# EAGLE design SparkFun_ESP8266_Thing_dimensions_added (EAGLE 7.6.0)
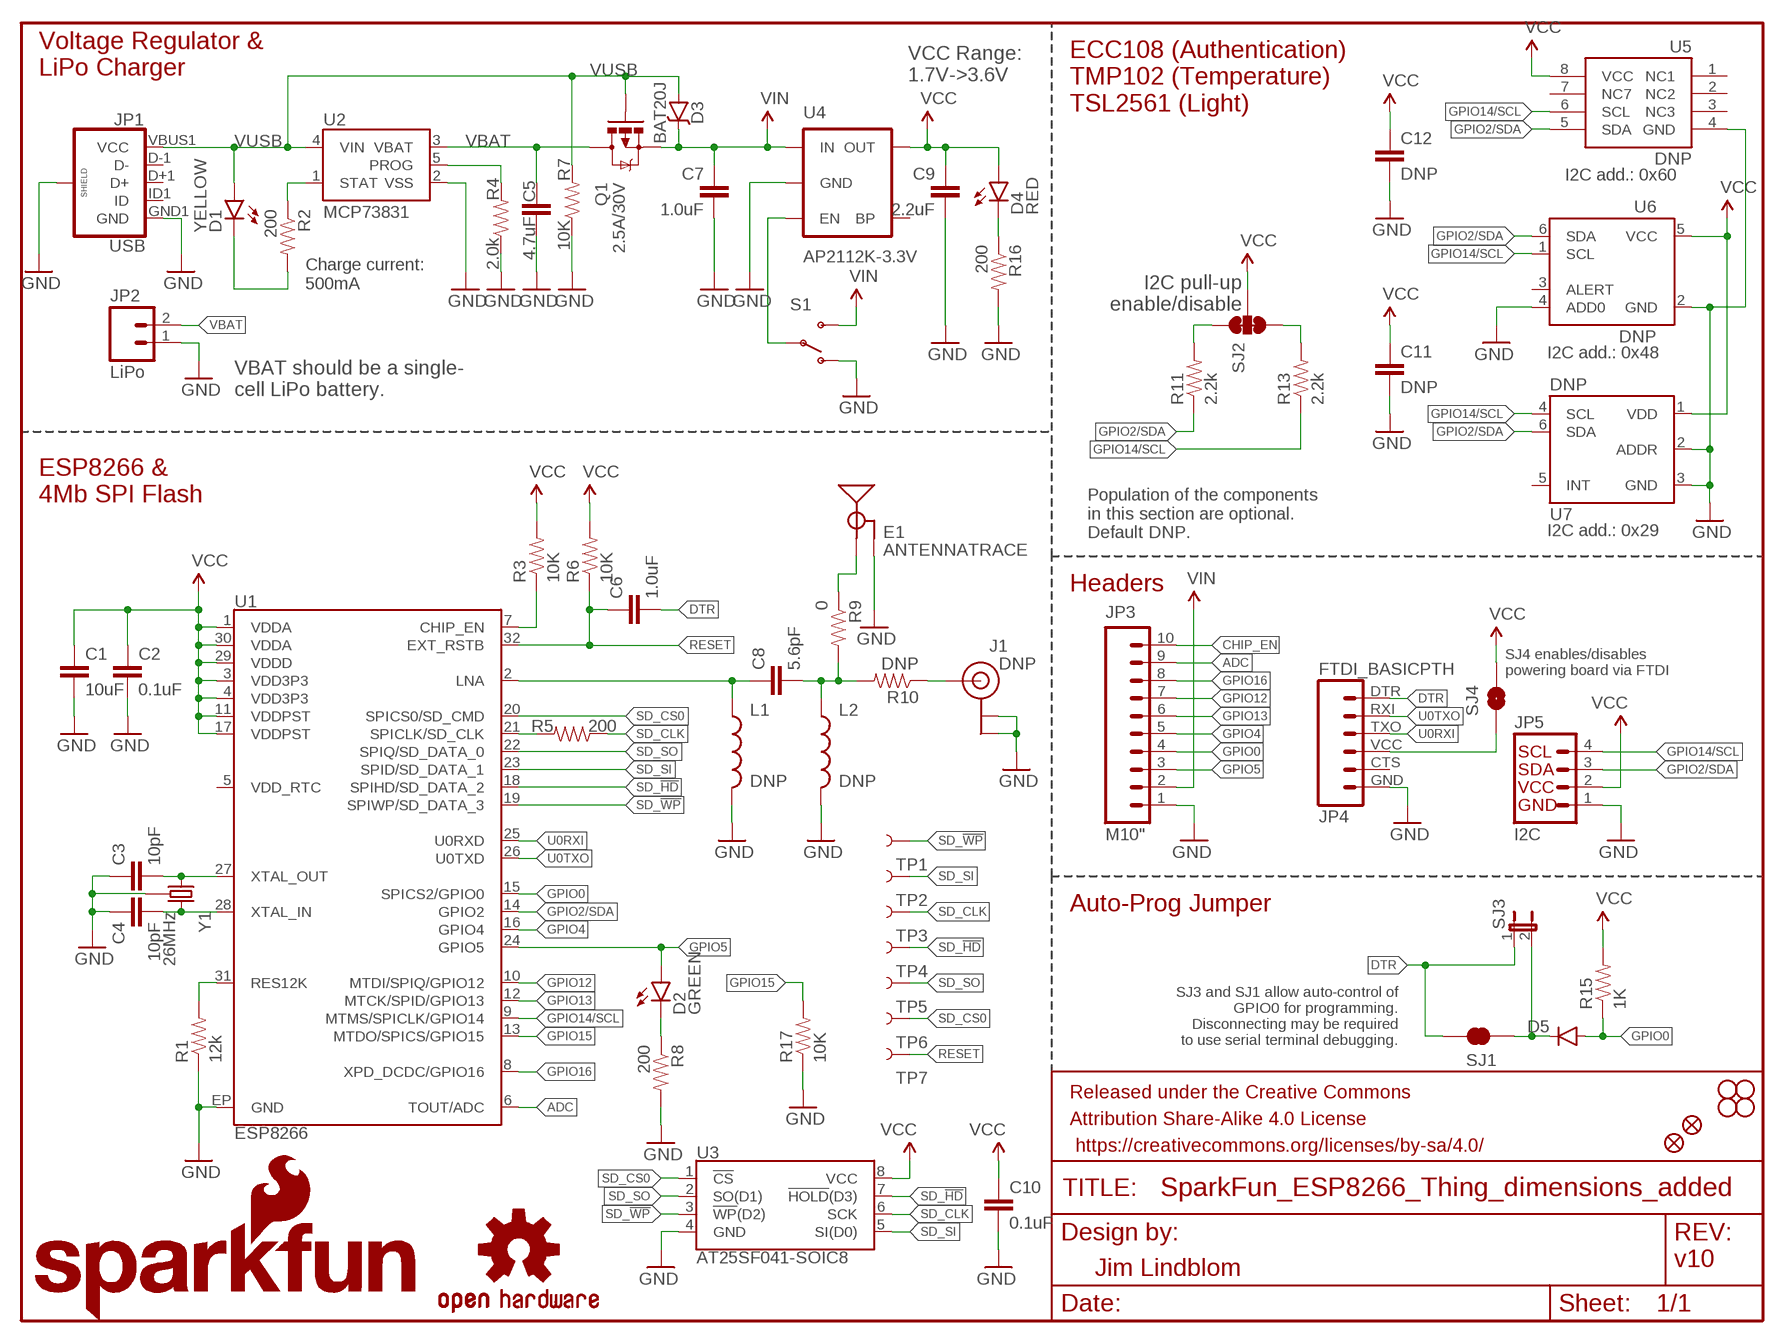
[diagram p0: schematic, sheet 1]

## Parts
C1  10uF  10UF-6.3V-20%(0603)  [0603-CAP]
C2  0.1uF  0.1UF-25V(+80/-20%)(0603)  [0603-CAP]
C3  10pF  10PF-50V-5%(0603)  [0603-CAP]
C4  10pF  10PF-50V-5%(0603)  [0603-CAP]
C5  4.7uF  4.7UF-6.3V-10%(0603)0603  [0603-CAP]
C6  1.0uF  1.0UF-16V-10%(0603)  [0603-CAP]
C7  1.0uF  1.0UF-25V-+80/-20(0805)  [0805]
C8  5.6pF  CAP0603-CAP  [0603-CAP]
C9  2.2uF  2.2UF-10V-20%(0603)  [0603-CAP]
C10  0.1uF  0.1UF-25V(+80/-20%)(0603)  [0603-CAP]
C11  DNP  0.1UF-25V(+80/-20%)(0603)  [0603-CAP]
C12  DNP  0.1UF-25V(+80/-20%)(0603)  [0603-CAP]
D1  YELLOW  LED-YELLOW0603  [LED-0603]
D2  GREEN  LED-GREEN0603  [LED-0603]
D3  BAT20J  DIODE-SCHOTTKY-BAT20J  [SOD-323]
D4  RED  LED-RED0603  [LED-0603]
D5  DIODEBAS16  [SOD-323]
E1  ANTENNATRACE  [TRACE_ANTENNA_2.4GHZ_25.7MM]
FID1  FIDUCIAL1X2  [FIDUCIAL-1X2]
FID2  FIDUCIAL1X2  [FIDUCIAL-1X2]
FRAME1  FRAME-LETTER  [CREATIVE_COMMONS]
J1  DNP  U.FL  [U.FL]
JP1  USB  USB_MICROB_PLUGCONN-11752  [USB-B-MICRO-SMD_V03]
JP2  LiPo  M02JST-PTH-2  [JST-2-PTH]
JP3  M10"  [1X10]
JP4  FTDI_BASICPTH  [FTDI_BASIC]
JP5  I2C  I2C_STANDARD  [1X04]
L1  DNP  INDUCTOR0603  [0603]
L2  DNP  INDUCTOR0603  [0603]
LOGO1  SFE_LOGO_NAME.2_INCH  [SFE_LOGO_NAME_.2]
LOGO3  SFE_LOGO_FLAME.1_INCH  [SFE_LOGO_FLAME_.1]
LOGO4  OSHW-LOGOS  [OSHW-LOGO-S]
Q1  2.5A/30V  MOSFET-PCHANNELDMG2307L  [SOT23-3]
R1  12k  12KOHM-1/10W-1%(0603)  [0603-RES]
R2  200  200OHM1/10W1%(0603)  [0603-RES]
R3  10K  10KOHM1/10W1%(0603)0603  [0603-RES]
R4  2.0k  2.0KOHM1/10W5%(0603)  [0603-RES]
R5  200  200OHM1/10W1%(0603)  [0603-RES]
R6  10K  10KOHM1/10W1%(0603)0603  [0603-RES]
R7  10K  10KOHM1/10W1%(0603)0603  [0603-RES]
R8  200  200OHM1/10W1%(0603)  [0603-RES]
R9  0  0OHM1/10W5%(0603)  [0603]
R10  DNP  RESISTOR0603-RES  [0603-RES]
R11  2.2k  2.2KOHM1/10W1%(0603)  [0603-RES]
R13  2.2k  2.2KOHM1/10W1%(0603)  [0603-RES]
R15  1K  1KOHM1/10W1%(0603)  [0603-RES]
R16  200  200OHM1/10W1%(0603)  [0603-RES]
R17  10K  10KOHM1/10W1%(0603)0603  [0603-RES]
S1  SWITCH-SPDT-SMD-A  [SWITCH-SPST-SMD-A]
SJ1  JUMPER-PAD-2-NC_BY_TRACE  [PAD-JUMPER-2-NC_BY_TRACE_YES_SILK]
SJ2  JUMPER-PAD-3-NC_BY_TRACE  [PAD-JUMPER-3-3OF3_NC_BY_TRACE_YES_SILK_FULL_BOX]
SJ3  JUMPER-PTH-2-NC  [PTH-JUMPER-NC_BOTTOM_NO_SILK]
SJ4  JUMPER-PAD-2-NOYES_SILK  [PAD-JUMPER-2-NO_YES_SILK]
STANDOFF1  STAND-OFF  [STAND-OFF]
STANDOFF2  STAND-OFF  [STAND-OFF]
STANDOFF3  STAND-OFF  [STAND-OFF]
STANDOFF4  STAND-OFF  [STAND-OFF]
TP1  TEST-POINT3X5  [PAD.03X.05]
TP2  TEST-POINT3X5  [PAD.03X.05]
TP3  TEST-POINT3X5  [PAD.03X.05]
TP4  TEST-POINT3X5  [PAD.03X.05]
TP5  TEST-POINT3X5  [PAD.03X.05]
TP6  TEST-POINT3X5  [PAD.03X.05]
TP7  TEST-POINT3X5  [PAD.03X.05]
U1  ESP8266  [QFN32]
U2  MCP73831  [SOT23-5]
U3  AT25SF041-SOIC8  [SO08]
U4  AP2112K-3.3V  V_REG_LDOSMD  [SOT23-5]
U5  DNP  ATECC108-MAHDA  [UDFN8]
U6  DNP  TMP1021:1  [SOT563-2]
U7  DNP  TSL2561FN  [FN-6]
Y1  26MHz  CRYSTAL-GROUNDED3.2X2.5  [CRYSTAL-SMD-3.2X2.5]

## Nets
ADC: JP3.9 U1.6(TOUT/ADC)
ANT: J1.P$3(SIGNAL) R10.1
CHIP_EN: JP3.10 R3.1 U1.7(CHIP_EN)
DTR: C6.2 JP4.DTR SJ1.2 SJ3.1
FTDI_VCC: JP4.VCC SJ4.1
GND: C1.2 C2.2 C3.1 C4.1 C5.2 C7.2 C9.2 C10.2 C11.2 C12.2 E1.GND E1.GND2(GND) J1.P$1(GND) J1.P$2(GND) JP1.GND1(GND) JP1.SHIELD1(SHIELD) JP1.SHIELD2(SHIELD) JP1.SHIELD3(SHIELD) JP2.1 JP3.1 JP4.GND JP5.1 L1.2 L2.2 R1.1 R4.1 R7.1 R8.2 R16.2 R17.1 S1.1(O) U1.EP(GND) U2.2(VSS) U3.4(GND) U4.2(GND) U5.4(GND) U6.2(GND) U6.4(ADD0) U7.2(ADDR) U7.3(GND) Y1.2(GND) Y1.4(GND)
GPIO0: D5.A JP3.4 R15.1 U1.15(SPICS2/GPIO0)
GPIO2/SDA: JP5.3 R11.1 U1.14(GPIO2) U5.5(SDA) U6.6(SDA) U7.6(SDA)
GPIO4: JP3.5 U1.16(GPIO4)
GPIO5: D2.A JP3.3 U1.24(GPIO5)
GPIO12: JP3.7 U1.10(MTDI/SPIQ/GPIO12)
GPIO13: JP3.6 U1.12(MTCK/SPID/GPIO13)
GPIO14/SCL: JP5.4 R13.1 U1.9(MTMS/SPICLK/GPIO14) U5.6(SCL) U6.1(SCL) U7.4(SCL)
GPIO15: R17.2 U1.13(MTDO/SPICS/GPIO15)
GPIO16: JP3.8 U1.8(XPD_DCDC/GPIO16)
LNA: C8.1 L1.1 U1.2(LNA)
N$1: R1.2 U1.31(RES12K)
N$2: C4.2 U1.28(XTAL_IN) Y1.3
N$3: C3.2 U1.27(XTAL_OUT) Y1.1
N$4: D4.C R16.1
N$5: C8.2 L2.1 R9.2 R10.2
N$6: R5.2 U1.21(SPICLK/SD_CLK)
N$7: D5.C SJ1.1 SJ3.2
N$9: R11.2 SJ2.1
N$10: R13.2 SJ2.3
N$11: S1.2(P) U4.3(EN)
N$14: R4.2 U2.5(PROG)
N$15: D2.C R8.1
N$17: D1.C R2.2
N$18: R2.1 U2.1(STAT)
RESET: C6.1 R6.1 TP7.P$1 U1.32(EXT_RSTB)
SD_!HD!: TP4.P$1 U1.18(SPIHD/SD_DATA_2) U3.7(!HOLD!(D3))
SD_!WP!: TP1.P$1 U1.19(SPIWP/SD_DATA_3) U3.3(!WP!(D2))
SD_CLK: R5.1 TP3.P$1 U3.6(SCK)
SD_CS0: TP6.P$1 U1.20(SPICS0/SD_CMD) U3.1(!CS!)
SD_SI: TP2.P$1 U1.23(SPID/SD_DATA_1) U3.5(SI(D0))
SD_SO: TP5.P$1 U1.22(SPIQ/SD_DATA_0) U3.2(SO(D1))
TRACE_ANT: E1.ANT(SIGNAL) R9.1
U0RXI: JP4.TXO U1.25(U0RXD)
U0TXO: JP4.RXI U1.26(U0TXD)
VBAT: C5.1 JP2.2 Q1.3(D) U2.3(VBAT)
VCC: C1.1 C2.1 C9.1 C10.1 C11.1 C12.1 D4.A JP5.2 R3.2 R6.2 R15.2 SJ2.2 SJ4.2 U1.1(VDDA) U1.3(VDD3P3) U1.4(VDD3P3) U1.11(VDDPST) U1.17(VDDPST) U1.29(VDDD) U1.30(VDDA) U3.8(VCC) U4.5(OUT) U5.8(VCC) U6.5(VCC) U7.1(VDD)
VIN: C7.1 D3.C JP3.2 Q1.2(S) S1.3(S) U4.1(IN)
VUSB: D1.A D3.A JP1.VBUS1(VCC) Q1.1(G) R7.2 U2.4(VIN)
Unconnected: JP1.D+1(D+) JP1.D-1(D-) JP1.ID1(ID) JP4.CTS U1.5(VDD_RTC) U4.4(BP) U5.1(NC1) U5.2(NC2) U5.3(NC3) U5.7(NC7) U6.3(ALERT) U7.5(INT)

## Notes on the sheet
- Voltage Regulator &
  LiPo Charger
- VCC Range:
  1.7V->3.6V
- ECC108 (Authentication)
  TMP102 (Temperature)
  TSL2561 (Light)
- I2C add.: 0x60
- Charge current:
  500mA
- I2C pull-up
  enable/disable
- I2C add.: 0x48
- VBAT should be a single-
  cell LiPo battery.
- ESP8266 &
  4Mb SPI Flash
- I2C add.: 0x29
- Population of the components 
  in this section are optional. 
  Default DNP.
- Headers
- DNP
- SJ4 enables/disables
  powering board via FTDI
- Auto-Prog Jumper
- SJ3 and SJ1 allow auto-control of
  GPIO0 for programming.
  Disconnecting may be required
  to use serial terminal debugging.
- v10
- Jim Lindblom

## Library data of the parts
C1 = SparkFun-Capacitors:10UF-6.3V-20%(0603): CAP-11015; PROD_ID: CAP-11015
C2 C10 = SparkFun-Capacitors:0.1UF-25V(+80/-20%)(0603): CAP-00810 Ceramic Standard decoupling cap; PROD_ID: CAP-00810
C3 C4 = SparkFun-Capacitors:10PF-50V-5%(0603): CAP-11812; PROD_ID: CAP-11812
C5 = SparkFun-Capacitors:4.7UF-6.3V-10%(0603): CAP-08280; PROD_ID: CAP-08280
C6 = SparkFun-Capacitors:1.0UF-16V-10%(0603): CAP-00868; PROD_ID: CAP-00868
C7 = SparkFun-Capacitors:1.0UF-25V-+80/-20(0805): CAP-11625; PROD_ID: CAP-11625
C8 = SparkFun-Capacitors:CAP: Capacitor Standard 0603 ceramic capacitor, and 0.1" leaded capacitor.
C9 = SparkFun-Capacitors:2.2UF-10V-20%(0603): CAP-07888; PROD_ID: CAP-07888
C11 C12 = SparkFun-Capacitors:0.1UF-25V(+80/-20%)(0603): CAP-00810 Ceramic Standard decoupling cap; PROD_ID: CAP-00810; VALUE: 0.1uF
D1 = SparkFun-LED:LED-YELLOW: Yellow SMD LEDs LilyPad 1206- DIO-09909 0603- DIO-09003; PROD_ID: DIO-09003
D2 = SparkFun-LED:LED-GREEN: Various green LEDs Green LEDs used in SFE Production 0603- DIO-00821 LARGE- DIO-00862 LILYPAD- DIO-09910; PROD_ID: DIO-00821
D3 = SparkFun-DiscreteSemi:DIODE-SCHOTTKY: Schottky diodes in SFE's production catalog BAT20J 1A 23V 0.62Vf RB751 120mA 40V 0.37Vf PMEG4005EJ 0.5A 40V 0.42Vf MBRA140 1A 40V 0.5Vf B340A 3A 40V SMA; PROD_ID: DIO-11623
D4 = SparkFun-LED:LED-RED: Assorted Red LEDs LilyPad 1206- DIO-09912 1206- DIO-00809 0603- DIO-00819; PROD_ID: DIO-00819
D5 = SparkFun-DiscreteSemi:DIODE: Diode These are standard reverse protection diodes and small signal diodes. SMA package can handle up to about 1A. SOD-323 can handle about 200mA. What the SOD-323 package when ordering, there are some mfgs out there that are 5-pin packages.; PROD_ID: DIO-09646; VALUE: 250mA/100V
E1 = SparkFun-RF:ANTENNA: Chip antenna Chip antenna with ground or secondary connection. Common with larger metal RF connectors.
FID1 FID2 = SparkFun-Aesthetics:FIDUCIAL: Fiducial Alignment Points Various fiducial points for machine vision alignment.
FRAME1 = SparkFun-Aesthetics:FRAME-LETTER: Schematic Frame Standard 8.5x11 US Letter frame
J1 = SparkFun-Connectors:U.FL: SMD antenna connector- WRL-09144; PROD_ID: CONN-09193; VALUE: U.FL
JP1 = SparkFun-Connectors:USB_MICROB_PLUG: USB Micro-B connectors Some male, some female. Watch your step!; PROD_ID: CONN-11752
JP2 = SparkFun-Connectors:M02: Standard 2-pin 0.1" header. Use with - straight break away headers ( PRT-00116) - right angle break away headers (PRT-00553) - swiss pins (PRT-00743) - machine pins (PRT-00117) - female headers (PRT-00115) Molex polarized connector foot print use with: PRT-08233 with associated crimp pins and housings. 2.54_SCREWTERM for use with PRT-10571. 3.5mm Screw Terminal footprints for PRT-08084 5mm Screw Terminal footprints for use with PRT-08432; SKU: PRT-09914
JP3 = SparkFun-Connectors:M10: Header 10 Standard 10-pin 0.1" header. Use with straight break away headers (SKU : PRT-00116), right angle break away headers (PRT-00553), swiss pins (PRT-00743), machine pins (PRT-00117), and female headers (PRT-00115).
JP4 = SparkFun-Connectors:FTDI_BASIC: FTDI Basic header with labels
JP5 = SparkFun-Connectors:I2C_STANDARD: SparkFun has standardized on a pinout for all I2C based sensor breakouts. This pinout allows I2C boards to be plugged directly into the headers on Arduino Uno compatible boards, and to be daisy chained easily.
L1 L2 = SparkFun-Passives:INDUCTOR: Inductors Basic Inductor/Choke - 0603 and 1206. Footprints are not proven and vary greatly between part numbers. SRN6045- 33uH, 20% 1.4A SDR0403-560KL - 56uH, 10%, 500mA RMS/740mA peak
LOGO1 = SparkFun-Aesthetics:SFE_LOGO_NAME: SFE Logo, name only This is the SparkFun name logo. The logo on the schematic will always be the same size; the package variant is the height of the flame part of the logo (or the height the flame would be, if it were drawn). Default layer for the logo on the board is tSilk.
LOGO3 = SparkFun-Aesthetics:SFE_LOGO_FLAME: SFE Logo, flame only This is the SparkFun flame logo. The logo on the schematic will always be the same size; the package variant is the height of the flame. Default layer for the logo on the board is tSilk.
LOGO4 = SparkFun-Aesthetics:OSHW-LOGO: Open Source Hardware Logo This logo indicates the piece of hardware it is found on incorporates a OSHW license and/or adheres to the definition of open source hardware found here: http://freedomdefined.org/OSHW
Q1 = SparkFun-DiscreteSemi:MOSFET-PCHANNEL: Generic PMOSFET IRLML2244 - TRANS-11153 (SOT-23 -20V -4.3A) (1.Gate 2.Source 3.Drain) FQP27P06 - COM-10349 <http://www.sparkfun.com/products/10349> (TO-220 -60V -27A) (1.Gate 2.Source 3.Drain); PROD_ID: TRANS-11308
R1 = SparkFun-Resistors:12KOHM-1/10W-1%(0603): RES-10327; PROD_ID: RES-10327
R2 R5 R8 R16 = SparkFun-Resistors:200OHM1/10W1%(0603): RES-08220; PROD_ID: RES-08220
R3 R6 R7 R17 = SparkFun-Resistors:10KOHM1/10W1%(0603): RES-00824; PROD_ID: RES-00824
R4 = SparkFun-Resistors:2.0KOHM1/10W5%(0603): RES-08296; PROD_ID: RES-08296
R9 = SparkFun-Resistors:0OHM1/10W5%(0603): RES-08609; PROD_ID: RES-08609
R10 = SparkFun-Passives:RESISTOR: Resistor Basic schematic elements and footprints for 0603, 1206, and PTH resistors.
R11 R13 = SparkFun-Resistors:2.2KOHM1/10W1%(0603): RES-08272; PROD_ID: RES-08272
R15 = SparkFun-Resistors:1KOHM1/10W1%(0603): RES-07856; PROD_ID: RES-07856
S1 = SparkFun-Electromechanical:SWITCH-SPDT: SPDT Switch Simple slide switch, Spark Fun Electronics SKU : COM-00102 DPDT SMT slide switch, AYZ0202, SWCH-08179; PROD_ID: SWCH-10651
SJ1 = SparkFun-Passives:JUMPER-PAD-2-NC_BY_TRACE
SJ2 = SparkFun-Passives:JUMPER-PAD-3-NC_BY_TRACE
SJ3 = SparkFun-Passives:JUMPER-PTH-2-NC
SJ4 = SparkFun-Passives:JUMPER-PAD-2-NO
STANDOFF1-STANDOFF4 = SparkFun-Electromechanical:STAND-OFF: #4 Stand Off This is the mechanical footprint for a #4 phillips button head screw. Use the keepout ring to avoid running the screw head into surrounding components. SKU : PRT-00447
TP1-TP7 = SparkFun-Passives:TEST-POINT: Bare copper test points for troubleshooting or ICT
U1 = SparkFun-RF:ESP8266: Espressif ESP8266 WiFi Smart Connectivity Platform.; PROD_ID: IC-12452
U2 = SparkFun-PowerIC:MCP73831: Miniature single cell, fully integrated Li-Ion, Li-polymer charge management controller http://ww1.microchip.com/downloads/en/DeviceDoc/21984a.pdf IC-09995; PROD_ID: IC-09995
U3 = SparkFun-DigitalIC:AT25SF041: SPI Serial Flash Memory with Dual/Quad-IO Support Example: Adesto Technologies AT25SF041-SSHD-T (1265-1131-1-ND) <http://www.digikey.com/product-detail/en/AT25SF041-SSHD-T/1265-1131-1-ND/4824165>; PROD_ID: IC-12455
U4 = SparkFun-PowerIC:V_REG_LDO: Voltage Regulator LDO Standard 150mA LDO voltage regulator in SOT-23 layout. Micrel part MIC5205. BP (by-pass) pin is used to lower output noise with 470pF cap.; PROD_ID: VREG-12457
U5 = SparkFun-DigitalIC:ATECC108: ATECC108: Provides ECDSA with NIST curves P256, B283, and K283. Also, a RNG, 8.5Kb EEPROM. 2.0V - 5.5V.; PROD_ID: IC-12453
U6 = SparkFun-Sensors:TMP102: I2C degC temp sensor
U7 = SparkFun-Sensors:TSL2561: TSL2561 illumination sensor Approximates Human Eye Response Precisely Measures Illuminance Programmable Interrupt Function with User-Defined Upper and Lower Threshold 400 KHz I2C interface Programmable Analog Gain and Integration Time Supporting 1,000,000-to-1 Dynamic Range Automatically Rejects 50/60-Hz Lighting Ripple Low Active Power (0.75 mW Typical) with Power Down Mode RoHS Compliant The TSL2561 is a light-to-digital converter that transform light intensity to a digital signal output via I2C interface. The device combines one broadband photodiode (visible plus infrared) and one infrared-responding photodiode on a single CMOS integrated circuit capable of providing a near-photopic response over an effective 20-bit dynamic range (16-bit resolution). Two integrating ADCs convert the photodiode currents to a digital output that represents the irradiance measured on each channel. This digital output can be input to a microprocessor where illuminance (ambient light level) in lux is derived using an empirical formula to approximate the human eye response. The TSL2561 device supports a traditional level style interrupt that remains asserted until the firmware clears it.
Y1 = things:CRYSTAL-GROUNDED; PROD_ID: XTAL-12454

## Board
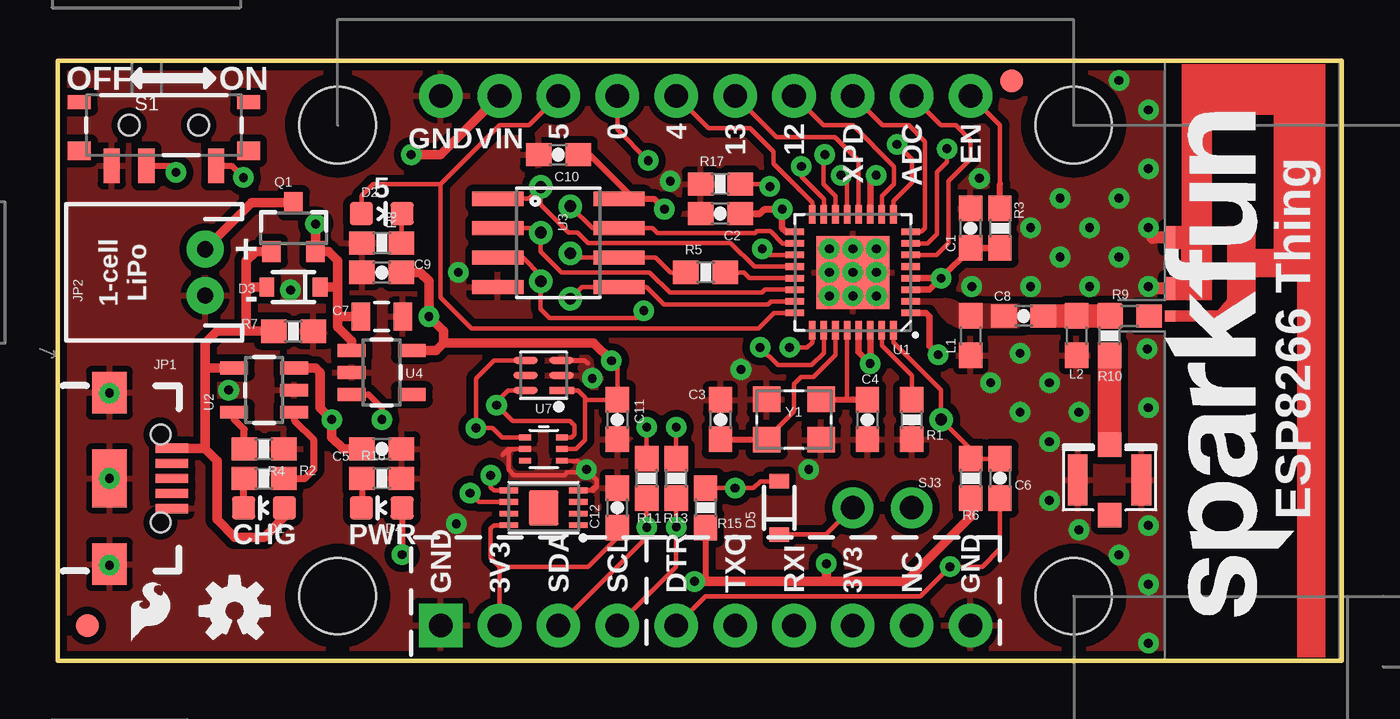
[diagram p1: board, top side]
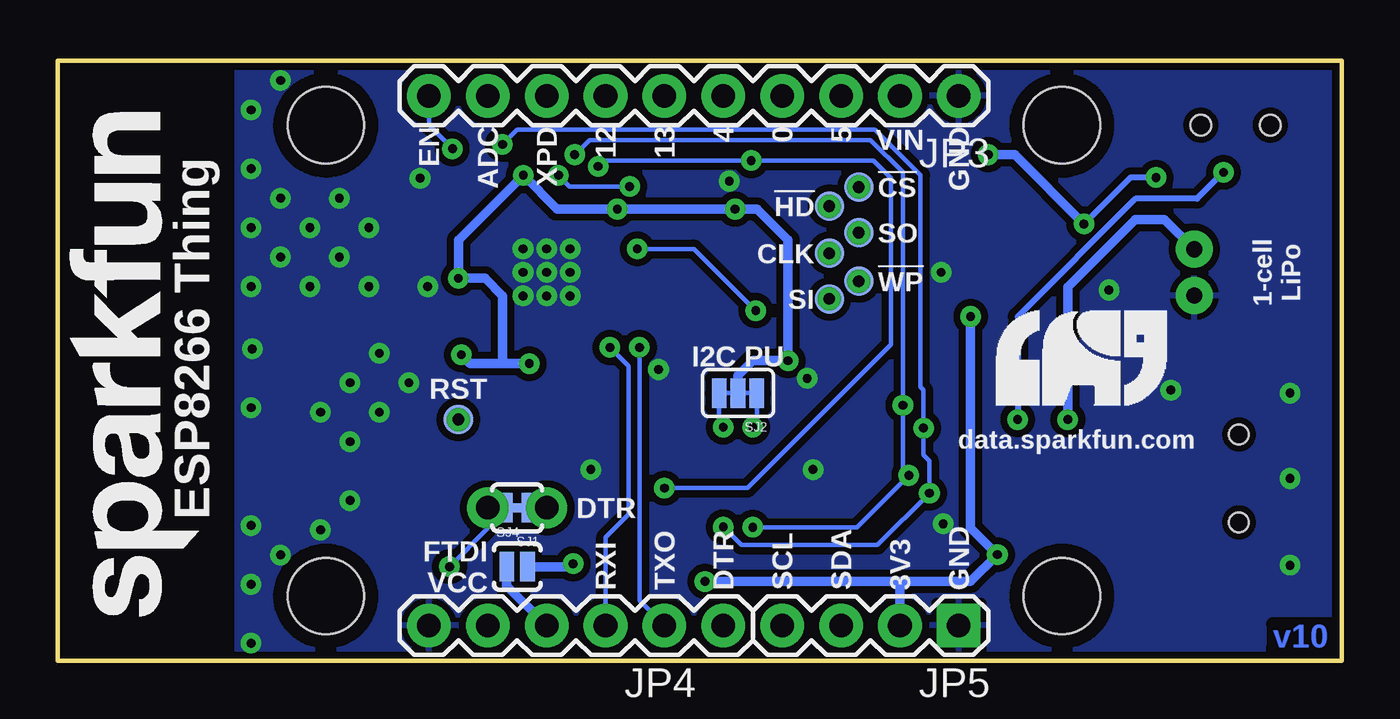
[diagram p2: board, bottom side, seen from below]

Size 55.37 x 25.91 mm. Coordinates in mm from the lower left corner, seen from the top.
Outline: 0,0 0,25.91 55.37,25.91 55.37,0 0,0
Copper layers (1*16): Top 0.035mm / dielectric 1.5mm / Bottom 0.035mm
Design rules "SparkFun-2-layer": minimum track width 7mil, minimum drill 15mil, track to track 8mil, track to pad 8mil, pad to pad 8mil, via to via 8mil, smd to smd 8mil, copper to edge 8mil, drill to drill 8mil, minimum pad ring 12mil, minimum via ring 10mil, stop-mask expansion 4mil, vias tented up to drill 20mil, thermal gap 10mil
tRestrict: 3 lines

### Footprints (pad centres in the part's own frame; a part is rotated, then mirrored left to right if it is on the bottom)
0603-CAP = smd 1.1 x 1: 1 -0.85,0; 2 0.85,0
0805 = smd 0.8 x 1.2: 1 -0.9,0; 2 0.9,0
LED-0603 = smd 1 x 1: A 0,-0.877; C 0,0.877
SOD-323 = smd 0.63 x 0.83: A 1.15,0; C -1.15,0
TRACE_ANTENNA_2.4GHZ_25.7MM = smd 0.46 x 0.46: ANT 0,0.23 | smd 1 x 0.46: GND -1.18,0.23; GND2 -3.38,0.23
FIDUCIAL-1X2 = smd 1 x 1: 1 0,0
U.FL = smd 2.2 x 0.85: P$1 0,1.375; P$2 0,-1.375 | smd 1.05 x 1: P$3 1.525,0; P$4 -1.525,0
USB-B-MICRO-SMD_V03 = smd 1.4 x 0.4: D+1 2.7,0; D-1 2.7,0.65; GND1 2.7,-1.3; ID1 2.7,-0.65; VBUS1 2.7,1.3 | smd 1.5 x 1.8: SHIELD1 0,3.7; SHIELD2 0,-3.7 | smd 1.5 x 2.5: SHIELD3 0,0 | hole 0.85: 2.2,1.9; 2.2,-1.9
JST-2-PTH = drill 0.7 pad 1.6: 1 -1,0; 2 1,0
1X10 = drill 1.016 pad 1.88: 1 0,0; 2 2.54,0; 3 5.08,0; 4 7.62,0; 5 10.16,0; 6 12.7,0; 7 15.24,0; 8 17.78,0; 9 20.32,0; 10 22.86,0
FTDI_BASIC = drill 1.016 pad 1.88: CTS 10.16,0; DTR 0,0; GND 12.7,0; RXI 2.54,0; TXO 5.08,0; VCC 7.62,0
1X04 = drill 1.016 pad 1.88 square: 1 0,0 | drill 1.016 pad 1.88: 2 2.54,0; 3 5.08,0; 4 7.62,0
0603 = smd 1.1 x 1: 1 -0.85,0; 2 0.85,0
SOT23-3 = smd 0.8 x 0.9: 1 -0.95,-1; 2 0.95,-1; 3 0,1.1
0603-RES = smd 1.1 x 1: 1 -0.85,0; 2 0.85,0
SWITCH-SPST-SMD-A = smd 0.7 x 1.5: 1 -2.25,-1.75; 2 -0.75,-1.75; 3 2.25,-1.75 | smd 1 x 0.6: GND1 -3.65,1; GND3 3.65,1 | smd 1 x 0.8: GND2 -3.65,-1.1; GND4 3.65,-1.1 | hole 0.9: -1.5,0; 1.5,0
PAD-JUMPER-2-NC_BY_TRACE_YES_SILK = smd 0.635 x 1.27: 1 -0.508,0; 2 0.508,0
PAD-JUMPER-3-3OF3_NC_BY_TRACE_YES_SILK_FULL_BOX = smd 0.635 x 1.27: 1 -0.813,0; 2 0,0; 3 0.813,0
PTH-JUMPER-NC_BOTTOM_NO_SILK = drill 1.016 pad 1.778: 1 -1.27,0; 2 1.27,0 | smd 1.27 x 0.381 bottom: P$1 0,0
PAD-JUMPER-2-NO_YES_SILK = smd 0.635 x 1.27: 1 -0.45,0; 2 0.45,0
STAND-OFF = hole 3.302: 0,0
PAD.03X.05 = smd 1.27 x 1.27: P$1 0,0
QFN32 = smd 0.8 x 0.285: 1 -2.5,1.75; 2 -2.5,1.25; 3 -2.5,0.75; 4 -2.5,0.25; 5 -2.5,-0.25; 6 -2.5,-0.75; 7 -2.5,-1.25; 8 -2.5,-1.75; 17 2.5,-1.75; 18 2.5,-1.25; 19 2.5,-0.75; 20 2.5,-0.25; 21 2.5,0.25; 22 2.5,0.75; 23 2.5,1.25; 24 2.5,1.75 | smd 0.285 x 0.8: 9 -1.75,-2.5; 10 -1.25,-2.5; 11 -0.75,-2.5; 12 -0.25,-2.5; 13 0.25,-2.5; 14 0.75,-2.5; 15 1.25,-2.5; 16 1.75,-2.5; 25 1.75,2.5; 26 1.25,2.5; 27 0.75,2.5; 28 0.25,2.5; 29 -0.25,2.5; 30 -0.75,2.5; 31 -1.25,2.5; 32 -1.75,2.5 | smd 3.15 x 3.15: EP 0,0
SOT23-5 = smd 0.55 x 1.2: 1 -0.95,-1.3; 2 0,-1.3; 3 0.95,-1.3; 4 0.95,1.3; 5 -0.95,1.3
SO08 = smd 0.61 x 2.21: 1 -1.905,-2.616; 2 -0.635,-2.616; 3 0.635,-2.616; 4 1.905,-2.616; 5 1.905,2.616; 6 0.635,2.616; 7 -0.635,2.616; 8 -1.905,2.616
UDFN8 = smd 0.8 x 0.25: 1 -1.5,0.75; 2 -1.5,0.25; 3 -1.5,-0.25; 4 -1.5,-0.75; 5 1.5,-0.75; 6 1.5,-0.25; 7 1.5,0.25; 8 1.5,0.75 | smd 1.3 x 1.5: EP 0,0
SOT563-2 = smd 0.508 x 0.249: 1 -0.8,0.498; 2 -0.8,0.003; 3 -0.8,-0.506; 4 0.776,-0.506; 5 0.776,0.003; 6 0.776,0.498
FN-6 = smd 1.05 x 0.3: 1 -0.775,0.65; 2 -0.775,0; 3 -0.775,-0.65; 4 0.775,-0.65; 5 0.775,0; 6 0.775,0.65
CRYSTAL-SMD-3.2X2.5 = smd 1.2 x 1.1: 1 -1.175,-0.875; 2 1.175,-0.875; 3 1.175,0.875; 4 -1.175,0.875

### Placement (x,y rotation side)
C1  39.37,18.67 90 top
C2  28.57,19.3 180 top
C3  28.57,10.41 270 top
C4  34.92,10.41 90 top
C5  13.97,9.14 0 top
C6  40.64,7.87 270 top
C7  13.97,14.86 0 top
C8  41.66,14.88 0 top
C9  13.97,16.76 180 top
C10  21.59,21.84 180 top
C11  24.13,10.41 270 top
C12  24.13,6.6 90 top
D1  8.89,6.6 90 top
D2  13.97,19.3 270 top
D3  10.16,16.13 180 top
D4  13.97,6.6 90 top
D5  31.11,6.6 90 top
E1  47.75,14.88 270 top
FID1  41.15,25.02 0 top
FID2  1.27,1.52 0 top
FRAME1  -2.03,-18.29 0 top  (outside the outline)
J1  45.36,7.81 90 top
JP1  2.22,7.87 0 top
JP2  6.35,16.76 90 top
JP3  16.51,24.38 180 bottom
JP4  26.67,1.52 180 bottom
JP5  16.51,1.52 180 bottom
L1  39.37,14.03 270 top
L2  43.94,14.03 270 top
LOGO1  49.28,1.91 90 bottom
LOGO3  2.83,0.5 0 top
LOGO4  7.62,2.16 0 top
LOGO5  SFE_LOGO_NAME.2_INCH  [SFE_LOGO_NAME_.2]  53.34,1.91 90 top
Q1  10.16,18.67 0 top
R1  36.83,10.41 90 top
R2  8.89,7.87 180 top
R3  40.64,18.67 270 top
R4  8.89,9.14 180 top
R5  27.94,16.76 0 top
R6  39.37,7.87 270 top
R7  10.16,14.22 180 top
R8  13.97,18.03 180 top
R9  46.23,14.88 180 top
R10  45.36,14.03 90 top
R11  25.4,7.87 90 top
R13  26.67,7.87 90 top
R15  27.94,6.6 270 top
R16  13.97,7.87 0 top
R17  28.57,20.57 0 top
S1  4.57,23.11 0 top
SJ1  35.56,6.6 180 bottom
SJ2  26.04,11.56 180 bottom
SJ3  35.56,6.6 180 top
SJ4  35.56,4.06 0 bottom
STANDOFF1  43.81,23.11 0 top
STANDOFF2  43.81,2.79 0 top
STANDOFF3  12.06,23.11 0 top
STANDOFF4  12.06,2.79 0 top
TP1  20.83,16.38 0 bottom
TP2  22.1,15.62 0 bottom
TP3  22.1,17.59 0 bottom
TP4  22.1,19.62 0 bottom
TP5  20.83,18.48 0 bottom
TP6  20.83,20.45 0 bottom
TP7  38.1,10.41 0 bottom
U1  34.29,16.76 180 top
U2  8.89,11.68 90 top
U3  21.59,18.03 270 top
U4  13.97,12.45 270 top
U5  20.95,6.6 180 top
U6  20.95,9.14 0 top
U7  20.95,12.32 180 top
Y1  31.75,10.41 0 top

### Tracks (layer width: path | path; a pad name or v marks a point on that pad's centre or on a via)
ADC
  Top 0.203: U1.6 37.9,17.51 38.42,18.03 38.42,20.7 39.37,21.65 39.37,22.48 38.73,23.11 38.1,23.11 JP3.9
ANT
  Top 1.016: R10.1 J1.P$3
CHIP_EN  (via drill 0.38)
  Top 0.203: U1.7 37.51,18.01 37.91,18.42 37.91,21.08 38.35,21.53 v38.35,22.1 | 40.64,20.57 40.64,23.11 JP3.10
  Top 0.254: R3.1 40.64,20.57
  Bottom 0.203: v38.35,22.1 39.37,23.11 JP3.10
DTR  (via drill 0.38)
  Top 0.203: JP4.DTR 27.94,2.79 37.21,2.79 v38.48,4.06 39.88,4.06 40.64,4.83 C6.2
  Bottom 0.203: v38.48,4.06 36.83,5.71 SJ3.1 SJ1.2
FTDI_VCC
  Bottom 0.406: JP4.VCC 36.01,3.24 SJ4.1
GND  (via drill 0.38)
  Top 0.203: 23.11,7.49 22.98,7.35 U5.4 23.1,7.35 23.24,7.49 23.24,7.81 v22.8,8.25 22.77,8.29 | U6.4 22.41,8.64 22.77,8.29 | 22.77,8.29 22.61,8.13 21.97,8.13 21.84,8 19.68,8 19.43,8.25 19.43,9.02 19.56,9.15 U6.2 | 19.43,9.15 19.18,8.89 | U7.3 22.72,12.97 22.86,12.83
  Top 0.508: E1.GND2 47.23,18.26 | E1.GND 47.12,16.06 46.99,16.19
  other vias: 34.29,16.76 34.29,17.78 34.29,15.75 33.27,16.76 33.27,17.78 33.27,15.75 35.31,17.78 35.31,16.76 35.31,15.75 39.75,20.83 26.42,20.7 7.37,11.68 2.22,11.56 2.22,7.87 2.22,4.13 17.27,16.76 46.99,13.46 47.04,10.92 47.04,5.84 47.04,3.3 47.04,0.76 47.04,16.15 47.04,18.69 47.04,21.23 47.04,23.77 45.77,25.04 45.77,19.96 45.77,17.42 45.77,4.57 43.23,19.96 41.96,18.69 41.96,16.15 44.5,16.15 44.5,18.69 43.23,17.42 39.42,16.15 40.23,12 41.5,13.27 42.77,12 44.04,10.73 41.5,10.73 42.77,9.46 42.77,6.92 44.04,5.65 29.46,12.57 32.38,8.25 10.03,16 23.05,12.19 17.18,5.92
  pour Top (isolate 0.305, rank 6): 0,25.91 0,0 47.62,0 47.62,25.91
  pour Bottom (isolate 0.305): 0,25.91 0,0 47.62,0 47.62,25.91
GPIO0  (via drill 0.38)
  Top 0.203: v25.46,21.59 24.13,22.92 JP3.4 | U1.15 33.04,19.92 32.07,20.89 v32.07,21.34 | D5.A 30.31,7.75 30.01,7.45 v29.21,7.45 R15.1
  Bottom 0.203: v29.21,7.45 25.63,7.45 19.43,13.65 19.43,20.83 20.19,21.59 v25.46,21.59 31.81,21.59 v32.07,21.34
GPIO2/SDA  (via drill 0.38)
  Top 0.203: U1.14 33.54,20.05 33.02,20.57 33.02,21.78 v33.08,21.84 | U6.6 22.15,9.64 22.29,9.78 22.29,10.16 22.1,10.35 19.61,10.35 v18.92,11.03 18.92,11.18 19.42,11.67 U7.6 | R11.1 v25.4,5.77 25.4,5.33 JP5.3 | U5.5 18.81,7.35 18.67,7.49 v18.67,8
  Bottom 0.203: v33.08,21.84 32.45,22.48 20.32,22.48 18.92,21.08 v18.92,11.03 18.92,8.25 v18.67,8 20.9,5.77 v25.4,5.77
GPIO4
  Top 0.203: U1.16 32.54,19.78 30.86,21.46 30.86,21.97 29.84,22.99 28.07,22.99 JP3.5
GPIO5
  Top 0.203: U1.24 30.89,15.01 30.23,14.35 17.84,14.35 16.51,15.68 16.51,20.57 | JP3.3 20.32,23.11 19.05,23.11 16.51,20.57 | D2.A 13.09,20.08 13.59,20.57 16.51,20.57
GPIO12
  Top 0.203: U1.10 35.54,20.05 36.07,20.57 36.07,21.34 34.29,23.11 33.02,23.11 JP3.7
GPIO13
  Top 0.203: U1.12 34.54,21.59 33.53,22.61 30.99,22.61 JP3.6
GPIO14/SCL  (via drill 0.38)
  Top 0.203: U1.9 36.04,19.85 36.83,20.64 36.83,21.65 v36.2,22.29 | U7.4 18.81,12.97 18.03,12.19 v18.03,10.05 18.76,10.05 19.16,9.64 U6.1 | R13.1 v26.67,5.78 26.67,4.06 JP5.4 | U5.6 18.16,6.85 v17.78,7.23
  Bottom 0.203: v36.2,22.29 35.56,22.92 20.13,22.92 18.16,20.96 18.16,11.81 18.03,11.68 v18.03,10.05 18.03,8.89 17.78,8.64 v17.78,7.23 20.01,5 25.89,5 v26.67,5.78
GPIO15  (via drill 0.38)
  Top 0.203: U1.13 34.04,20.7 v33.78,20.96 | R17.2 30.61,20.57 v30.71,20.47
  Bottom 0.203: v33.78,20.96 33.3,20.47 v30.71,20.47
GPIO16
  Top 0.203: U1.8 37.25,18.51 37.4,18.67 37.4,22.42 36.7,23.11 35.56,23.11 JP3.8
LNA
  pour Top (isolate 0.012, rank 2, no thermals): 36.8,15.55 38.22,15.57 arc-45 38.9,15.33 41.4,15.33 41.4,14.43 38.9,14.43 arc-44 37.98,15.18 arc-25 37.98,15.18 arc71 37.6,15.47 36.8,15.47
N$1
  Top 0.203: U1.31 35.54,13.61 36.83,12.32 R1.2
N$2
  Top 0.203: U1.28 34.04,11.29 34.29,11.29
  Top 0.254: Y1.3 34.29,11.29 34.9,11.29 C4.2
N$3
  Top 0.203: U1.27 33.54,13.2 32.59,12.24 32.05,12.24 31.75,11.94 31.75,10.76 30.55,9.56
  Top 0.254: C3.2 30.55,9.56 Y1.1
N$4
  Top 0.254: R16.1 13.12,6.63 D4.C
N$5
  Top 1.016: C8.2 L2.1 R10.2 R9.2
N$6
  Top 0.203: U1.21 29.84,16.51 29.59,16.76 R5.2
N$7
  Top 0.203: D5.C 33.14,5.45 SJ3.2
  Bottom 0.203: SJ1.1 SJ3.2
N$9  (via drill 0.38)
  Top 0.203: R11.2 v25.4,10.08
  Bottom 0.203: v25.4,10.08 25.22,10.26 SJ2.1
N$10  (via drill 0.38)
  Top 0.203: R13.2 v26.67,10.08
  Bottom 0.203: v26.67,10.08 26.85,10.26 SJ2.3
N$11  (via drill 0.38)
  Top 0.254: U4.3 13.4,11.5 13.97,10.93 v13.97,10.41 | S1.2 4.81,21.36 v5.09,21.08
  Bottom 0.254: v13.97,10.41 13.97,14.86 8.89,19.94 6.24,19.94 v5.09,21.08
N$14
  Top 0.305: R4.2 8.04,9.99 7.59,10.44 U2.5
N$15
  Top 0.203: R8.1 14.82,19.28 D2.C
N$17
  Top 0.305: D1.C 8.01,7.85 R2.2
N$18
  Top 0.305: R2.1 10.67,7.87 11.05,8.25 11.05,9.53 10.19,10.38 U2.1
RESET  (via drill 0.51)
  Top 0.203: U1.32 36.04,13.74 38.1,11.68 TP7.P$1 39.37,9.14 R6.1 C6.1
  other vias: 38.1,10.41
SD_!HD!  (via drill 0.51)
  Top 0.203: U1.18 31.26,18.01 30.73,18.54 30.15,18.54 30.07,18.47 25.86,18.47 25.65,18.67 U3.7 23.05,18.67 TP4.P$1
  other vias: 22.1,19.62
SD_!WP!  (via drill 0.38, 0.51)
  Top 0.203: U1.19 30.64,17.51 v30.38,17.78 | v25.27,15.11 24.96,14.79 21.21,14.79 20.83,15.18 TP1.P$1 20.83,16.64 20.07,17.4 U3.3
  Bottom 0.203: v30.38,17.78 27.94,17.78 v25.27,15.11
  other vias: 20.83,16.38
SD_CLK  (via drill 0.51)
  Top 0.203: R5.1 26.42,16.76 25.78,17.4 U3.6 22.29,17.4 TP3.P$1
  other vias: 22.1,17.59
SD_CS0  (via drill 0.51)
  Top 0.203: U1.20 30.04,17.01 29.02,18.03 22.86,18.03 22.42,18.48 22.04,18.48 20.83,19.69 TP6.P$1 20.32,19.94 U3.1
  other vias: 20.83,20.45
SD_SI  (via drill 0.51)
  Top 0.203: U1.23 30.75,15.51 30.63,15.39 26.14,15.39 25.4,16.13 U3.5 22.61,16.13 TP2.P$1
  other vias: 22.1,15.62
SD_SO  (via drill 0.51)
  Top 0.203: U1.22 30.49,16.01 30.36,15.89 26.4,15.89 25.53,16.76 21.72,16.76 20.83,17.65 TP5.P$1 20.64,18.67 U3.2
  other vias: 20.83,18.48
TRACE_ANT
  pour Top (no thermals): 46.99,14.48 46.99,15.29 47.62,15.29 arc30 47.83,15.01 47.83,14.74 arc30 47.64,14.48
U0RXI  (via drill 0.38)
  Top 0.203: U1.25 32.54,13.74 32.32,13.53 v31.56,13.53
  Bottom 0.203: JP4.TXO 31.75,5.33 30.76,6.32 30.76,12.72 v31.56,13.53
U0TXO  (via drill 0.38)
  Top 0.203: U1.26 33.04,13.29 32.51,12.76 31.05,12.76 v30.29,13.53
  Bottom 0.203: v30.29,13.53 30.29,2.6 JP4.RXI
VBAT  (via drill 0.38)
  Top 0.406: C5.1 12.32,9.14 11.81,9.65 v11.81,10.41 11.3,10.92 11.3,12.45 11.12,12.63 U2.3 | Q1.3 8.36,19.77 JP2.2
  Bottom 0.406: v11.81,10.41 11.81,16.13 8.89,19.05 7.64,19.05 JP2.2
VCC  (via drill 0.38)
  Top 0.203: 22.73,11.26 22.73,9.53 22.36,9.15 U6.5 | 22.73,11.26 22.73,11.37 22.43,11.67 U7.1 | 19.05,4.06 18.67,4.45 18.67,5.71 18.81,5.85 U5.8 | 19.05,4.06 JP5.2 | v23.88,12.95 24.13,12.7 C11.1 22.73,11.26 | C12.1 24.13,5.33 22.86,4.06 19.05,4.06
  Top 0.254: C10.1 22.92,21.84 24.83,19.94 | v26.16,19.5 25.72,19.94 24.83,19.94 | 24.83,19.94 U3.8 | D4.A v14.85,4.58 | R15.2 27.94,3.43
  Top 0.279: U1.30 v35.04,12.83 34.54,13.33 U1.29 | U1.1 37.44,15.01 37.59,14.86 37.59,13.59 v37.97,13.21 | U1.11 35.04,20.7 v35.29,20.96 | R3.2 C1.1 39.37,17.78 v38.1,16.51 | 37.6,16.01 U1.3 37.6,16.01 v38.1,16.51 | v38.1,16.51 U1.4 | U1.17 31.4,18.51 31.24,18.67 v31.24,19.5
  Top 0.305: C2.1 30.29,19.3 30.48,19.5 v31.24,19.5
  Top 0.406: 33.15,3.43 27.94,3.43 v27.46,3.43 | 33.15,3.43 36.58,3.43 39.37,6.22 R6.2 | v33.15,4.19 33.15,3.43 | C9.1 15.62,16.76 16,16.38 v16,14.86 16.64,14.22 16.64,13.72 | U4.5 16.32,13.4 16.64,13.72 | v23.88,12.95 23.11,13.72 16.64,13.72
  Bottom 0.406: 36.2,12.83 37.59,12.83 v37.97,13.21 | 36.2,12.83 v35.04,12.83 | 36.2,12.83 36.2,15.75 36.96,16.51 v38.1,16.51 38.1,18.15 v35.29,20.96 33.83,19.5 v31.24,19.5 v26.16,19.5 25.21,19.5 23.88,18.16 v23.88,12.95 25.4,12.95 26.04,12.32 SJ2.2 | SJ4.2 33.27,4.06 v33.15,4.19 | v27.46,3.43 19.05,3.43 | JP5.2 19.05,3.43 | 19.05,3.43 16,3.43 v14.85,4.58 16,5.74 v16,14.86
VIN  (via drill 0.38)
  Top 0.254: S1.3 7.49,21.36 v8,20.86
  Top 0.406: 12.06,16.13 12.06,17.27 11.67,17.67 Q1.2 v11.11,18.85 v11.11,18.86 | D3.C 12.06,16.13 | v15.24,21.84 16.51,21.84 JP3.2 | 12.06,16.13 12.06,14.86 | 12.06,14.86 12.06,14.4 12.67,13.8 U4.1 | C7.1 12.06,14.86
  Bottom 0.254: v8,20.86 9.11,20.86 v11.11,18.86
  Bottom 0.406: v15.24,21.84 14.1,21.84 v11.11,18.86
VUSB
  Top 0.305: 6.35,9.17 6.35,9.14
  Top 0.406: JP1.VBUS1 6.35,9.17 6.35,12.63 | 6.35,9.14 6.86,8.64 6.86,6.1 7.62,5.33 8.89,5.33 9.77,6.21 D1.A | 6.35,12.63 6.35,13.72 6.86,14.22 8.13,14.22 | 8.13,14.22 8.13,16.13 | 8.13,16.13 8.13,17.27 8.53,17.67 Q1.1 | D3.A 8.13,16.13 | 8.13,14.22 R7.2 | U2.4 6.35,12.63

### Text on the board
Bottom: v10
tPlace: OFF | ON | GND | VIN | 5 | 0 | 4 | 13 | 12 | XPD | ADC | EN | 5 | + | 1-cell / LiPo | - | CHG | PWR | ESP8266 Thing | GND | 3V3 | SDA | SCL | DTR | TXO | RXI | 3V3 | NC | GND
bPlace: GND | VIN | 5 | 0 | 4 | 13 | 12 | XPD | ADC | EN | !CS! | !HD! | SO | 1-cell / LiPo | CLK | !WP! | SI | I2C PU | RST | data.sparkfun.com | DTR | ESP8266 Thing | FTDI / VCC | GND | 3V3 | SDA | SCL | DTR | TXO | RXI
tDocu: Jim Lindblom | Dimensions by: | Michael de Silva (http://desilva.io)